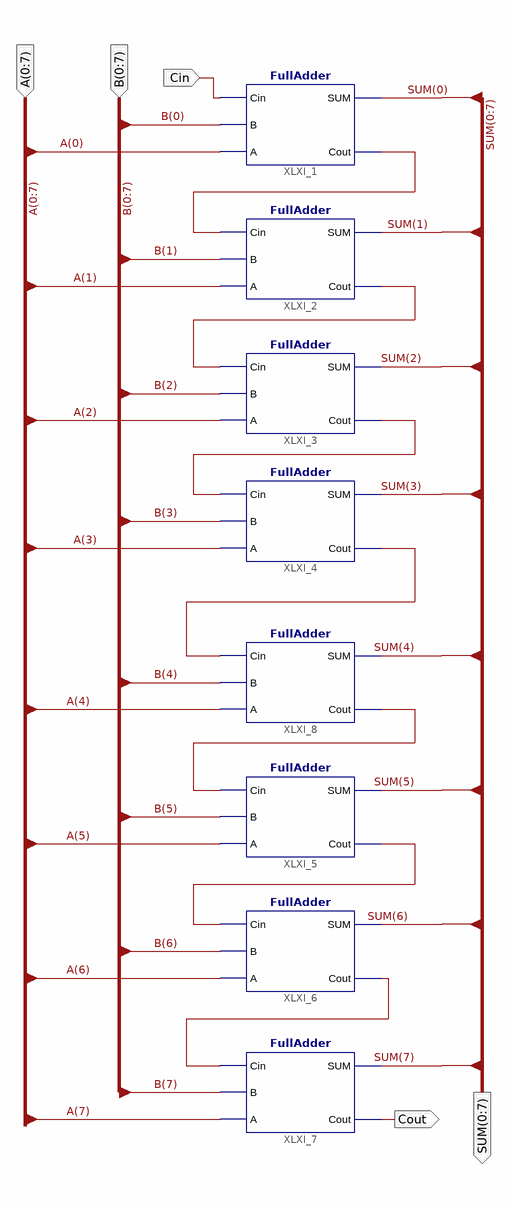
[diagram p0: schematic sheet 1]
// Xilinx ISE schematic FullAdder8Bit.sch (spartan6) as structural Verilog: 8 symbols, 5 ports
module FullAdder8Bit (
  input  [0:7] A,
  input  [0:7] B,
  input  Cin,
  output [0:7] SUM,
  output Cout
);

  wire XLXN_1, XLXN_2, XLXN_3, XLXN_4, XLXN_5, XLXN_6, XLXN_7;

  FullAdder XLXI_1 (.Cin(Cin), .B(B[0]), .A(A[0]), .SUM(SUM[0]), .Cout(XLXN_1));
  FullAdder XLXI_2 (.Cin(XLXN_1), .B(B[1]), .A(A[1]), .SUM(SUM[1]), .Cout(XLXN_2));
  FullAdder XLXI_3 (.Cin(XLXN_2), .B(B[2]), .A(A[2]), .SUM(SUM[2]), .Cout(XLXN_3));
  FullAdder XLXI_4 (.Cin(XLXN_3), .B(B[3]), .A(A[3]), .SUM(SUM[3]), .Cout(XLXN_4));
  FullAdder XLXI_5 (.Cin(XLXN_5), .B(B[5]), .A(A[5]), .SUM(SUM[5]), .Cout(XLXN_6));
  FullAdder XLXI_6 (.Cin(XLXN_6), .B(B[6]), .A(A[6]), .SUM(SUM[6]), .Cout(XLXN_7));
  FullAdder XLXI_7 (.Cin(XLXN_7), .B(B[7]), .A(A[7]), .SUM(SUM[7]), .Cout(Cout));
  FullAdder XLXI_8 (.Cin(XLXN_4), .B(B[4]), .A(A[4]), .SUM(SUM[4]), .Cout(XLXN_5));
endmodule
